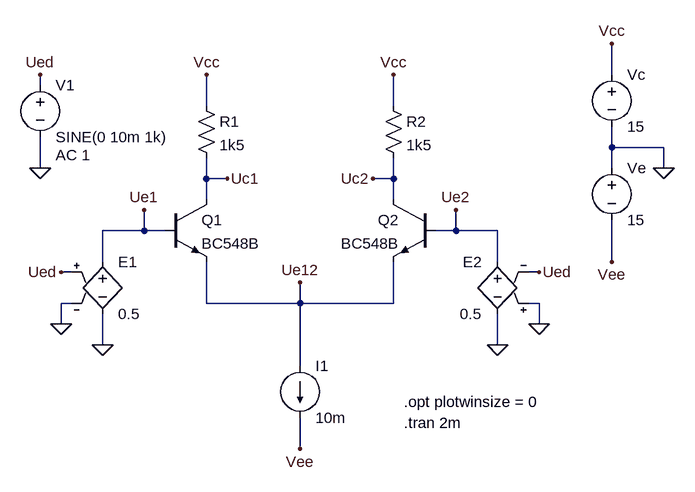
[diagram p0: schematic tran.asc]
tran.asc, the LTspice schematic file:
Version 4
SHEET 1 960 680
WIRE 608 -80 608 -128
WIRE -272 -64 -272 -80
WIRE -16 -32 -16 -80
WIRE 272 -32 272 -80
WIRE 608 32 608 0
WIRE 688 32 608 32
WIRE -272 64 -272 16
WIRE 608 64 608 32
WIRE 688 64 688 32
WIRE -16 80 -16 48
WIRE 16 80 -16 80
WIRE 272 80 272 48
WIRE 272 80 240 80
WIRE -16 112 -16 80
WIRE 272 112 272 80
WIRE -112 160 -112 128
WIRE -112 160 -176 160
WIRE -80 160 -112 160
WIRE 368 160 368 128
WIRE 368 160 336 160
WIRE 432 160 368 160
WIRE -176 208 -176 160
WIRE 432 208 432 160
WIRE 608 208 608 144
WIRE -224 224 -240 224
WIRE 496 224 480 224
WIRE -224 272 -240 272
WIRE -16 272 -16 208
WIRE 128 272 128 240
WIRE 128 272 -16 272
WIRE 272 272 272 208
WIRE 272 272 128 272
WIRE 496 272 480 272
WIRE -240 304 -240 272
WIRE 496 304 496 272
WIRE -176 336 -176 288
WIRE 432 336 432 288
WIRE 128 368 128 272
WIRE 128 496 128 448
FLAG 128 496 Vee
FLAG 688 64 0
FLAG 608 -128 Vcc
FLAG 608 208 Vee
FLAG -16 -80 Vcc
FLAG 272 -80 Vcc
FLAG 16 80 Uc1
FLAG 240 80 Uc2
FLAG 128 240 Ue12
FLAG -112 128 Ue1
FLAG 368 128 Ue2
FLAG -176 336 0
FLAG 432 336 0
FLAG -272 64 0
FLAG -272 -80 Ued
FLAG -240 304 0
FLAG 496 304 0
FLAG -240 224 Ued
FLAG 496 224 Ued
SYMBOL npn -80 112 R0
SYMATTR InstName Q1
SYMATTR Value BC548B
SYMBOL npn 336 112 M0
SYMATTR InstName Q2
SYMATTR Value BC548B
SYMBOL current 128 368 R0
WINDOW 123 0 0 Left 2
WINDOW 39 0 0 Left 2
SYMATTR InstName I1
SYMATTR Value 10m
SYMBOL res -32 -48 R0
SYMATTR InstName R1
SYMATTR Value 1k5
SYMBOL res 256 -48 R0
SYMATTR InstName R2
SYMATTR Value 1k5
SYMBOL voltage 608 -96 R0
WINDOW 123 0 0 Left 2
WINDOW 39 0 0 Left 2
SYMATTR InstName Vc
SYMATTR Value 15
SYMBOL voltage 608 48 R0
WINDOW 123 0 0 Left 2
WINDOW 39 0 0 Left 2
SYMATTR InstName Ve
SYMATTR Value 15
SYMBOL e -176 192 R0
SYMATTR InstName E1
SYMATTR Value 0.5
SYMBOL e2 432 192 M0
SYMATTR InstName E2
SYMATTR Value 0.5
SYMBOL voltage -272 -80 R0
WINDOW 123 24 124 Left 2
WINDOW 39 0 0 Left 2
SYMATTR Value2 AC 1
SYMATTR InstName V1
SYMATTR Value SINE(0 10m 1k)
TEXT 288 456 Left 2 !.tran 2m
TEXT 288 424 Left 2 !.opt plotwinsize = 0

The netlist it stands for:
* tran.asc
Q1 Uc1 Ue1 Ue12 0 BC548B
Q2 Uc2 Ue2 Ue12 0 BC548B
I1 Ue12 Vee 10m
R1 Vcc Uc1 1k5
R2 Vcc Uc2 1k5
Vc Vcc 0 15
Ve 0 Vee 15
E1 Ue1 0 Ued 0 0.5
E2 Ue2 0 0 Ued 0.5
V1 Ued 0 SINE(0 10m 1k) AC 1
.model NPN NPN
.model PNP PNP
.lib standard.bjt
.tran 2m
.opt plotwinsize = 0
.backanno
.end

* Results of the author's LTspice run, read from the files saved beside the schematic
* Operating Point, zero values left out:
*   V(uc1) = 7.522 V
*   V(ue12) = -704.1 mV
*   V(uc2) = 7.522 V
*   V(vee) = -15 V
*   V(vcc) = 15 V
*   Ic(Q2) = 4.985 mA
*   Ib(Q2) = 14.66 µA
*   Ie(Q2) = -5 mA
*   Ic(Q1) = 4.985 mA
*   Ib(Q1) = 14.66 µA
*   Ie(Q1) = -5 mA
*   I(I1) = 10 mA
*   I(R2) = 4.985 mA
*   I(R1) = 4.985 mA
*   I(E2) = -14.66 µA
*   I(E1) = -14.66 µA
*   I(Ve) = -10 mA
*   I(Vc) = -9.971 mA
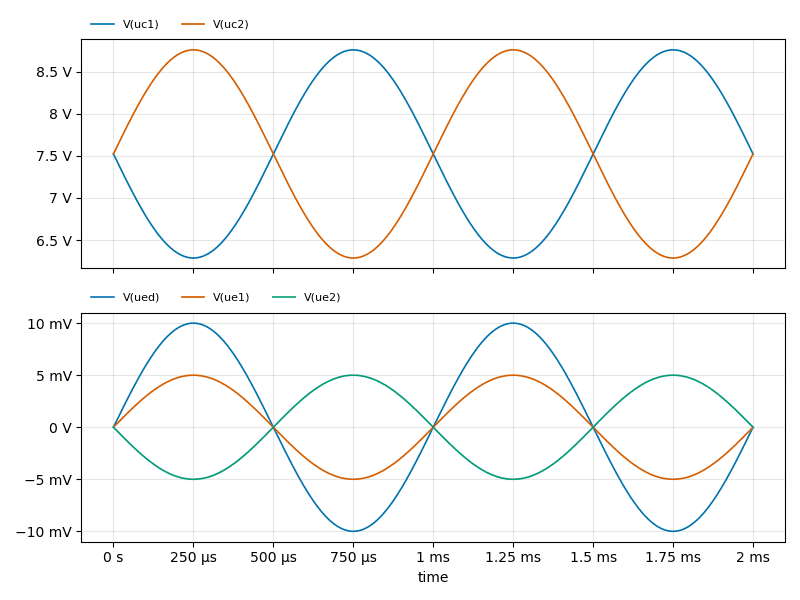
[diagram p1: Transient Analysis of tran.asc, plotted from the saved traces]
* Transient Analysis, 1 run:
*   V(uc1): min 6.287 V, max 8.757 V, average 7.522 V, rms 7.573 V, last 7.522 V
*   V(uc2): min 6.287 V, max 8.757 V, average 7.522 V, rms 7.573 V, last 7.522 V
*   V(ued): min -10 mV, max 10 mV, average 0 V, rms 7.071 mV, last 0 V
*   V(ue1): min -5 mV, max 5 mV, average 0 V, rms 3.535 mV, last 0 V
*   V(ue2): min -5 mV, max 5 mV, average 0 V, rms 3.535 mV, last 0 V